# EAGLE schematic CarteMere_V3 (EAGLE 8.4.0)
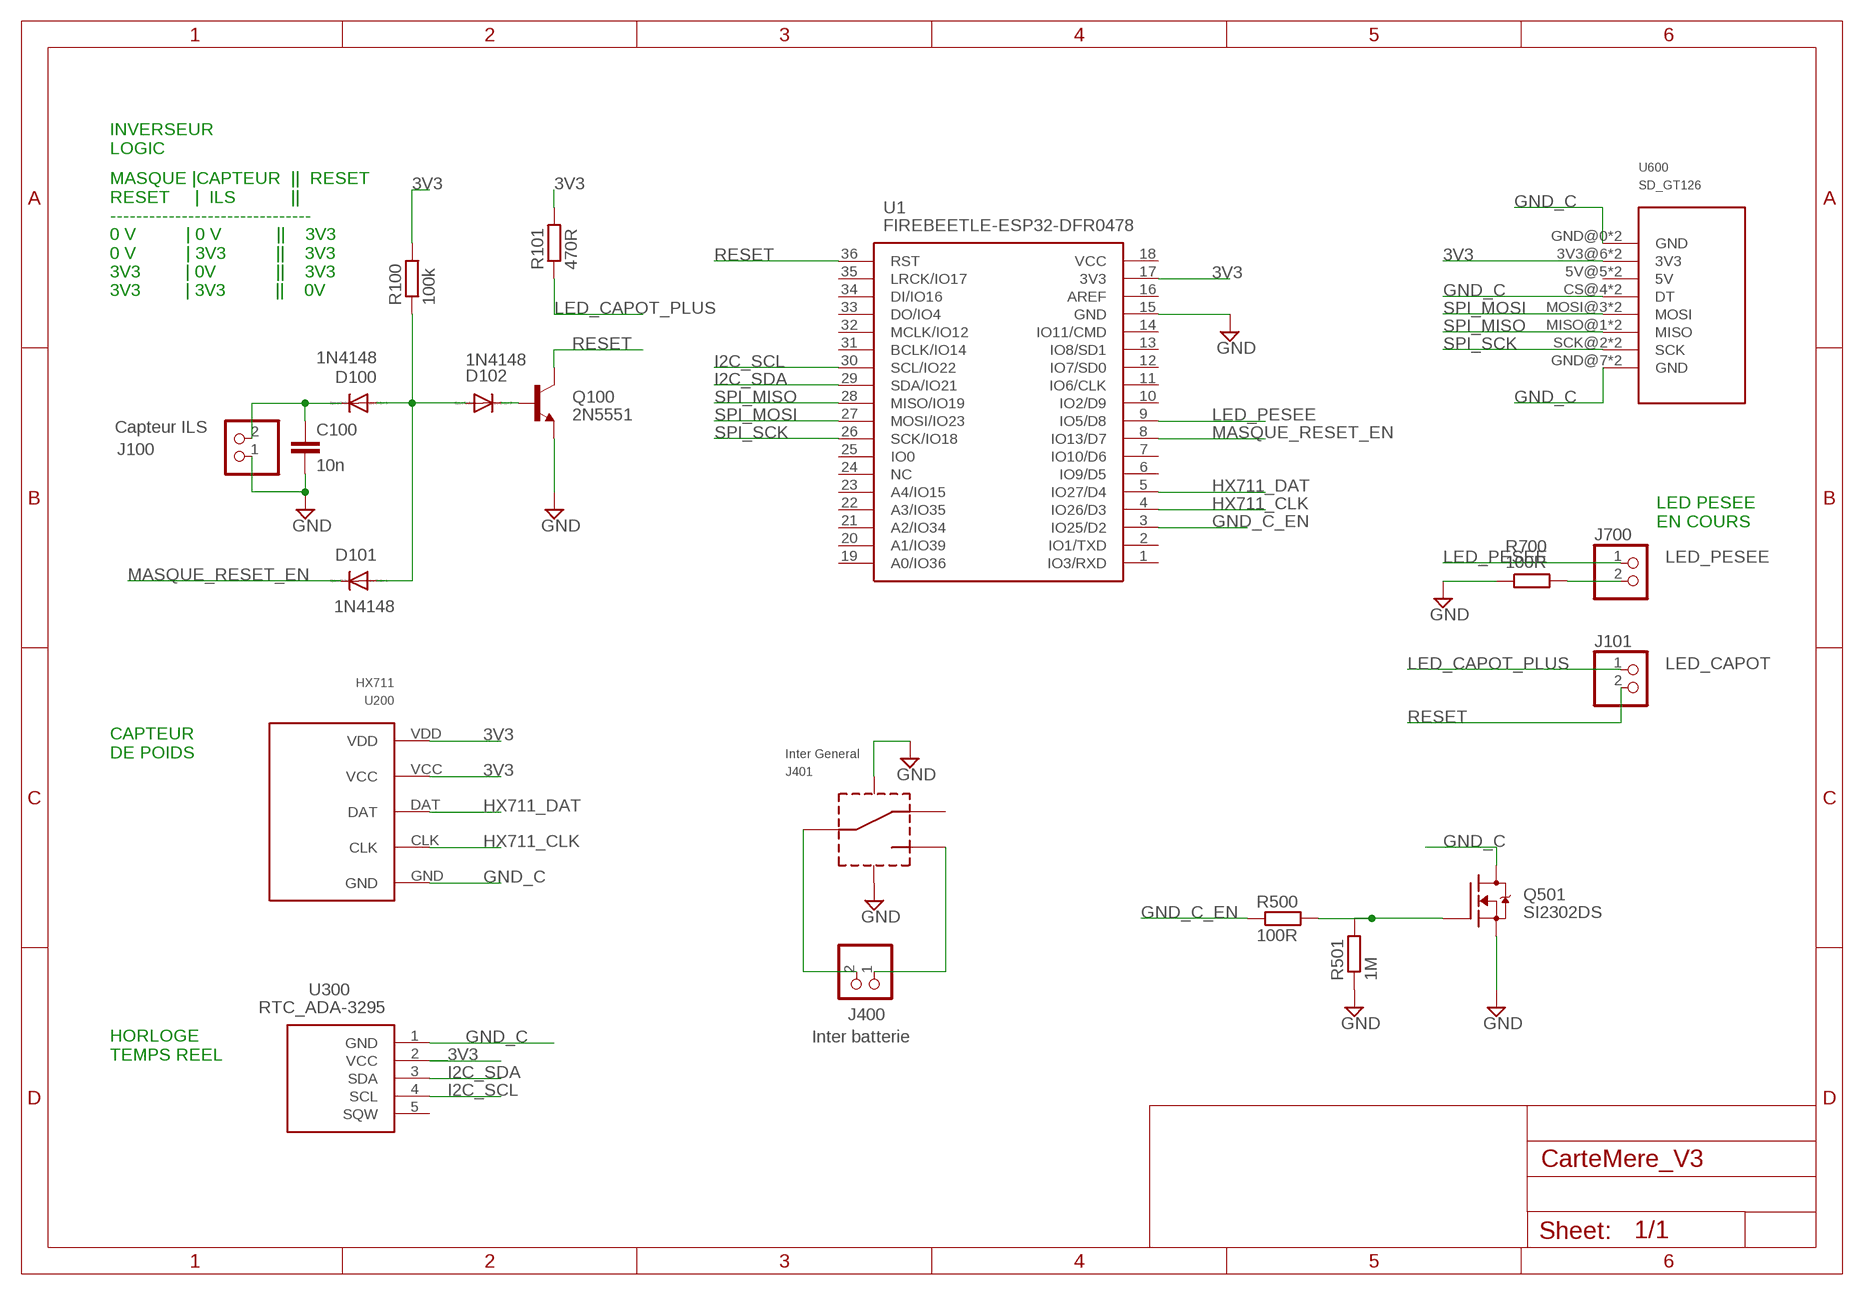
[diagram p0: schematic, sheet 1]

## Parts
C100  10n  C-EU050-035X075  [C050-035X075]
D100  1N4148  1N4148DO35-10  [DO35-10]
D101  1N4148  1N4148DO35-10  [DO35-10]
D102  1N4148  1N4148DO35-10  [DO35-10]
J100  Capteur ILS  PINHD-1X2  [1X02]
J101  LED_CAPOT  PINHD-1X2  [1X02]
J400  Inter batterie  PINHD-1X2  [1X02]
J401  Inter General  COMMUTATEUR_GLISSIERE_1RT_100MA  [COMMUTATEUR_GLISSIERE_1RT_100MA]
J700  LED_PESEE  PINHD-1X2  [1X02]
Q100  2N5551  2N5551-NPN-TO92-EBC  [TO92-EBC]
Q501  SI2302DS  [SOT23]
R100  100k  R_1/4W10  [0207/10]
R101  470R  R_1/4W10  [0207/10]
R500  100R  R_1/4W10  [0207/10]
R501  1M  R_1/4W10  [0207/10]
R700  100R  R_1/4W10  [0207/10]
U1  FIREBEETLE-ESP32-DFR0478  [FIREBEETLE_ESP32]
U200  HX711  SPARKFUN_HX711_LOAD_CELL  [SPARKFUN_HX711_LOAD_CELL]
U300  RTC_ADA-3295  [ADA3295]
U600  SD_GT126  [SD_GT126]

## Nets
3V3: R100.2 R101.2 U1.17(3V3) U200.VCC U200.VDD U300.2(VCC) U600.3V3@6(3V3) U600.3V3@9(3V3)
GND: C100.2 J100.1 J401.GNDA J401.GNDB Q100.E Q501.2(S) R501.1 R700.1 U1.15(GND)
GND_C: Q501.3(D) U200.GND U300.1(GND) U600.CS@4(DT) U600.CS@11(DT) U600.GND@0(GND) U600.GND@7(GND) U600.GND@8(GND) U600.GND@15(GND)
GND_C_EN: R500.1 U1.3(IO25/D2)
HX711_CLK: U1.4(IO26/D3) U200.CLK
HX711_DAT: U1.5(IO27/D4) U200.DAT
I2C_SCL: U1.30(SCL/IO22) U300.4(SCL)
I2C_SDA: U1.29(SDA/IO21) U300.3(SDA)
LED_CAPOT_PLUS: J101.1 R101.1
LED_PESEE: J700.1 U1.9(IO5/D8)
MASQUE_RESET_EN: D101.C U1.8(IO13/D7)
N$1: Q501.1(G) R500.2 R501.2
N$2: J700.2 R700.2
N$5: D100.A D101.A D102.A R100.1
N$6: C100.1 D100.C J100.2
N$8: D102.C Q100.B
N$11: J400.2 J401.COM
N$13: J400.1 J401.OUTA(OUT1)
RESET: J101.2 Q100.C U1.36(RST)
SPI_MISO: U1.28(MISO/IO19) U600.MISO@1(MISO) U600.MISO@14(MISO)
SPI_MOSI: U1.27(MOSI/IO23) U600.MOSI@3(MOSI) U600.MOSI@12(MOSI)
SPI_SCK: U1.26(SCK/IO18) U600.SCK@2(SCK) U600.SCK@13(SCK)
Unconnected: J401.OUTB(OUT2) U1.1(IO3/RXD) U1.2(IO1/TXD) U1.6(IO9/D5) U1.7(IO10/D6) U1.10(IO2/D9) U1.11(IO6/CLK) U1.12(IO7/SD0) U1.13(IO8/SD1) U1.14(IO11/CMD) U1.16(AREF) U1.18(VCC) U1.19(A0/IO36) U1.20(A1/IO39) U1.21(A2/IO34) U1.22(A3/IO35) U1.23(A4/IO15) U1.24(NC) U1.25(IO0) U1.31(BCLK/IO14) U1.32(MCLK/IO12) U1.33(DO/IO4) U1.34(DI/IO16) U1.35(LRCK/IO17) U300.5(SQW) U600.5V@5(5V) U600.5V@10(5V)

## Notes on the sheet
- INVERSEUR 
  LOGIC
- MASQUE |CAPTEUR  ||  RESET
  RESET     |  ILS           ||
  ------------------------------- 
  0 V          | 0 V           ||    3V3
  0 V          | 3V3          ||    3V3
  3V3         | 0V            ||    3V3
  3V3         | 3V3          ||    0V
- LED PESEE 
  EN COURS
- CAPTEUR 
  DE POIDS
- HORLOGE
  TEMPS REEL

## Library data of the parts
C100 = rcl:C-EU: CAPACITOR, European symbol
D100-D102 = diode:1N4148: DIODE high speed (Philips)
J100 J101 J400 J700 = pinhead:PINHD-1X2: PIN HEADER
J401 = Eagle_UOF_Lib:COMMUTATEUR_GLISSIERE_1RT_100MA
Q100 = transistor-neu-to92:*-NPN-: NPN Transistror
Q501 = Eagle_UOF_Lib:SI2302DS
R100 R101 R500 R501 R700 = Eagle_UOF_Lib:R_1/4W
U1 = Eagle_UOF_Lib:FIREBEETLE-ESP32-DFR0478: Development Boards & Kits - Wireless FireBeetle ESP32 IOT MCU Source: Datasheet <https://github.com/Robert-MARKII/Document/blob/master/FireBeetle Board-ESP32 User Manual update.pdf>; DESCRIPTION: Development Boards & Kits - Wireless FireBeetle ESP32 IOT MCU; HEIGHT: mm; MANUFACTURER_NAME: DFRobot; MANUFACTURER_PART_NUMBER: DFR0478; MOUSER_PART_NUMBER: 426-DFR0478; MOUSER_PRICE-STOCK: https://www.mouser.co.uk/ProductDetail/DFRobot/DFR0478?qs=EU6FO9ffTwc%252BR65h2NUGQw%3D%3D
U200 = Eagle_UOF_Lib:SPARKFUN_HX711_LOAD_CELL
U300 = Eagle_UOF_Lib:RTC_ADA-3295: Real Time Clock module Source: Datasheet <https://learn.adafruit.com/adafruit-pcf8523-real-time-clock/downloads>; DESCRIPTION: Real Time Clock module; HEIGHT: 3.5mm; MANUFACTURER_NAME: Adafruit; MANUFACTURER_PART_NUMBER: ADA-3295
U600 = Eagle_UOF_Lib:SD_GT126